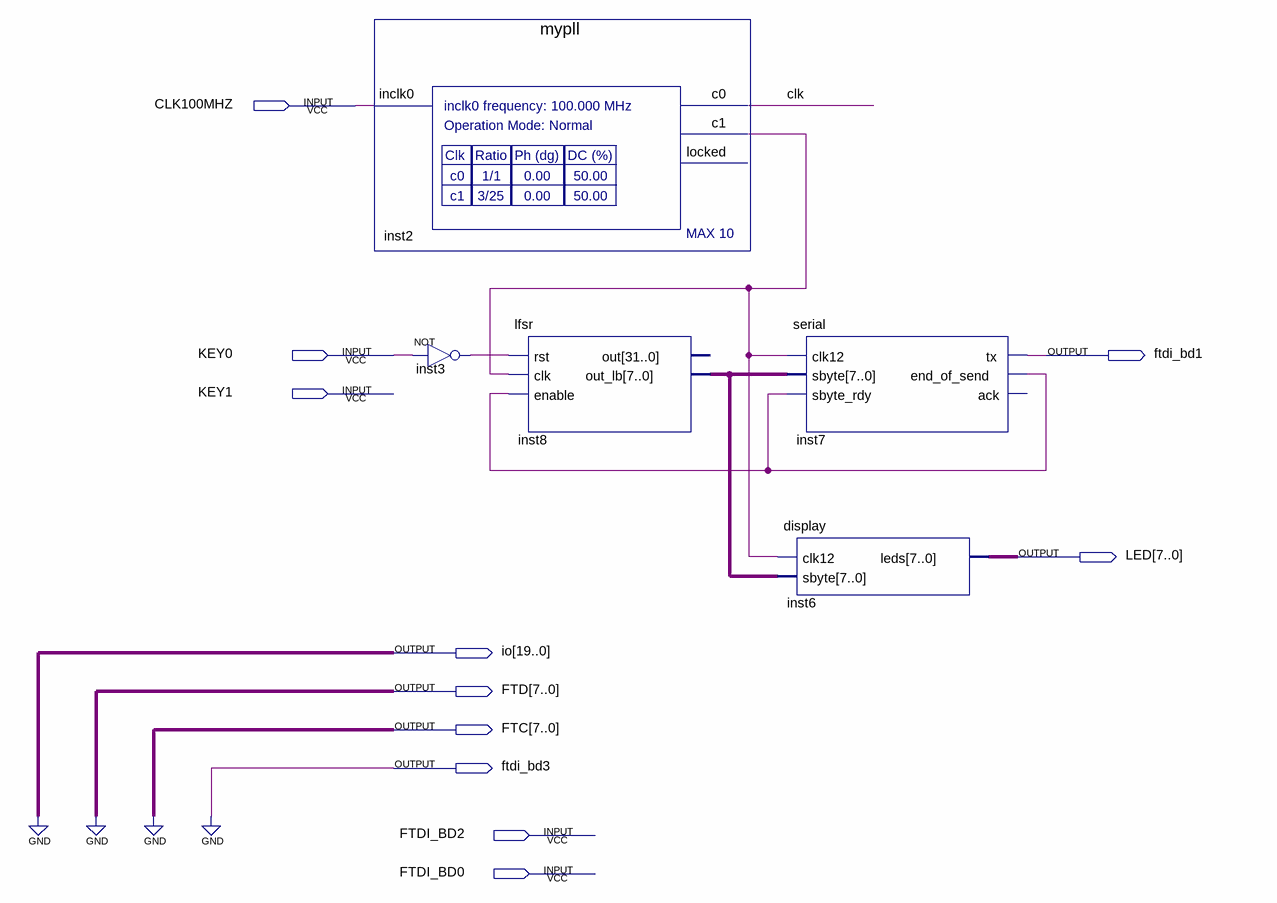
[diagram p0: schematic sheet]
// Quartus schematic max10.bdf as structural Verilog: 5 symbols, 11 pins
module max10 (
  input  CLK100MHZ,
  input  KEY0,
  input  KEY1,
  input  FTDI_BD2,
  input  FTDI_BD0,
  output ftdi_bd1,
  output [7:0] LED,
  output [19:0] io,
  output [7:0] FTD,
  output [7:0] FTC,
  output ftdi_bd3
);

  wire clk, inst2_c1, inst3_out, inst7_end_of_send;
  wire [7:0] inst8_out_lb;

  mypll inst2 (.inclk0(CLK100MHZ), .c0(clk), .c1(inst2_c1));  // open: locked
  not inst3 (inst3_out, KEY0);
  lfsr inst8 (.rst(inst3_out), .clk(inst2_c1), .enable(inst7_end_of_send), .out_lb(inst8_out_lb));  // open: out
  serial inst7 (
    .clk12(inst2_c1), .sbyte(inst8_out_lb), .sbyte_rdy(inst7_end_of_send), .tx(ftdi_bd1),
    .end_of_send(inst7_end_of_send));  // open: ack
  display inst6 (.clk12(inst2_c1), .sbyte(inst8_out_lb), .leds(LED));

  assign FTC = {8{1'b0}};
  assign FTD = {8{1'b0}};
  assign ftdi_bd3 = 1'b0;
  assign io = {20{1'b0}};
endmodule
